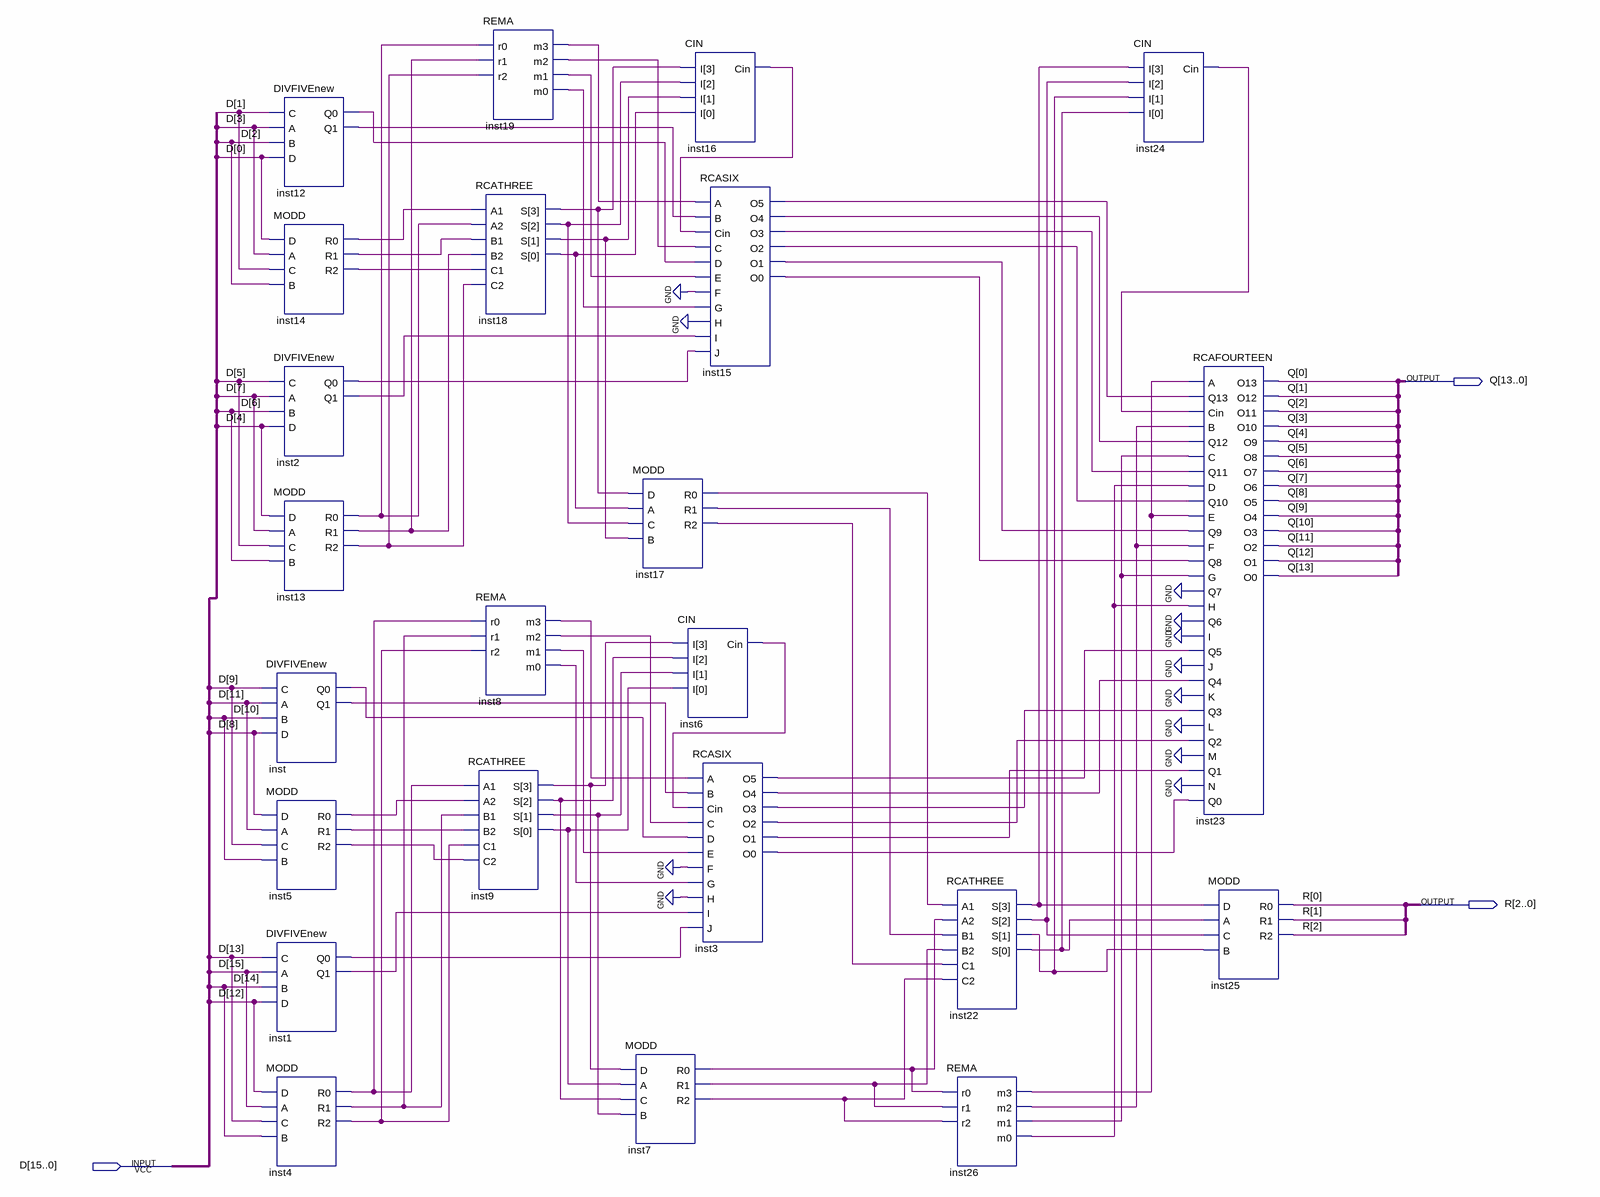
[diagram p0: schematic sheet]
// Quartus schematic DIV.bdf as structural Verilog: 23 symbols, 3 pins
module DIV (
  input  [15:0] D,
  output [13:0] Q,
  output [2:0] R
);

  wire inst1_q0, inst1_q1, inst2_q0, inst2_q1, inst3_o0, inst3_o1, inst3_o2, inst3_o3, inst3_o4, inst3_o5,
       inst4_r0, inst4_r1, inst4_r2, inst5_r0, inst5_r1, inst5_r2, inst6_cin, inst7_r0, inst7_r1, inst7_r2,
       inst8_m0, inst8_m1, inst8_m2, inst8_m3, inst9_s, inst9_s_2, inst9_s_3, inst9_s_4, inst12_q0,
       inst12_q1, inst13_r0, inst13_r1, inst13_r2, inst14_r0, inst14_r1, inst14_r2, inst15_o0, inst15_o1,
       inst15_o2, inst15_o3, inst15_o4, inst15_o5, inst16_cin, inst17_r0, inst17_r1, inst17_r2, inst18_s,
       inst18_s_2, inst18_s_3, inst18_s_4, inst19_m0, inst19_m1, inst19_m2, inst19_m3, inst22_s, inst22_s_2,
       inst22_s_3, inst22_s_4, inst24_cin, inst26_m0, inst26_m1, inst26_m2, inst26_m3, inst_q0, inst_q1;

  DIVFIVEnew inst12 (.C(D[1]), .A(D[3]), .B(D[2]), .D(D[0]), .Q0(inst12_q0), .Q1(inst12_q1));
  MODD inst14 (.D(D[0]), .A(D[3]), .C(D[1]), .B(D[2]), .R0(inst14_r0), .R1(inst14_r1), .R2(inst14_r2));
  DIVFIVEnew inst2 (.C(D[5]), .A(D[7]), .B(D[6]), .D(D[4]), .Q0(inst2_q0), .Q1(inst2_q1));
  MODD inst13 (.D(D[4]), .A(D[7]), .C(D[5]), .B(D[6]), .R0(inst13_r0), .R1(inst13_r1), .R2(inst13_r2));
  DIVFIVEnew inst (.C(D[9]), .A(D[11]), .B(D[10]), .D(D[8]), .Q0(inst_q0), .Q1(inst_q1));
  MODD inst5 (.D(D[8]), .A(D[11]), .C(D[9]), .B(D[10]), .R0(inst5_r0), .R1(inst5_r1), .R2(inst5_r2));
  DIVFIVEnew inst1 (.C(D[13]), .A(D[15]), .B(D[14]), .D(D[12]), .Q0(inst1_q0), .Q1(inst1_q1));
  MODD inst4 (.D(D[12]), .A(D[15]), .C(D[13]), .B(D[14]), .R0(inst4_r0), .R1(inst4_r1), .R2(inst4_r2));
  REMA inst19 (
    .r0(inst13_r0), .r1(inst13_r1), .r2(inst13_r2), .m3(inst19_m3), .m2(inst19_m2), .m1(inst19_m1),
    .m0(inst19_m0));
  RCATHREE inst18 (
    .A1(inst14_r0), .A2(inst13_r0), .B1(inst14_r1), .B2(inst13_r1), .C1(inst14_r2), .C2(inst13_r2),
    .S({inst18_s, inst18_s_3, inst18_s_4, inst18_s_2}));
  REMA inst8 (.r0(inst4_r0), .r1(inst4_r1), .r2(inst4_r2), .m3(inst8_m3), .m2(inst8_m2), .m1(inst8_m1), .m0(inst8_m0));
  RCATHREE inst9 (
    .A1(inst4_r0), .A2(inst5_r0), .B1(inst4_r1), .B2(inst5_r1), .C1(inst4_r2), .C2(inst5_r2),
    .S({inst9_s, inst9_s_3, inst9_s_4, inst9_s_2}));
  MODD inst17 (
    .D(inst18_s), .A(inst18_s_2), .C(inst18_s_3), .B(inst18_s_4), .R0(inst17_r0), .R1(inst17_r1),
    .R2(inst17_r2));
  MODD inst7 (.D(inst9_s), .A(inst9_s_2), .C(inst9_s_3), .B(inst9_s_4), .R0(inst7_r0), .R1(inst7_r1), .R2(inst7_r2));
  CIN inst16 (.I({inst18_s, inst18_s_3, inst18_s_4, inst18_s_2}), .Cin(inst16_cin));
  RCASIX inst15 (
    .A(inst19_m3), .B(inst12_q1), .Cin(inst16_cin), .C(inst19_m2), .D(inst12_q0), .E(inst19_m1), .F(1'b0),
    .G(inst19_m0), .H(1'b0), .I(inst2_q1), .J(inst2_q0), .O5(inst15_o5), .O4(inst15_o4), .O3(inst15_o3),
    .O2(inst15_o2), .O1(inst15_o1), .O0(inst15_o0));
  CIN inst6 (.I({inst9_s, inst9_s_3, inst9_s_4, inst9_s_2}), .Cin(inst6_cin));
  RCASIX inst3 (
    .A(inst8_m3), .B(inst_q1), .Cin(inst6_cin), .C(inst8_m2), .D(inst_q0), .E(inst8_m1), .F(1'b0),
    .G(inst8_m0), .H(1'b0), .I(inst1_q1), .J(inst1_q0), .O5(inst3_o5), .O4(inst3_o4), .O3(inst3_o3),
    .O2(inst3_o2), .O1(inst3_o1), .O0(inst3_o0));
  RCATHREE inst22 (
    .A1(inst17_r0), .A2(inst7_r0), .B1(inst17_r1), .B2(inst7_r1), .C1(inst17_r2), .C2(inst7_r2),
    .S({inst22_s, inst22_s_3, inst22_s_4, inst22_s_2}));
  REMA inst26 (
    .r0(inst7_r0), .r1(inst7_r1), .r2(inst7_r2), .m3(inst26_m3), .m2(inst26_m2), .m1(inst26_m1),
    .m0(inst26_m0));
  CIN inst24 (.I({inst22_s, inst22_s_3, inst22_s_4, inst22_s_2}), .Cin(inst24_cin));
  RCAFOURTEEN inst23 (
    .A(inst26_m3), .Q13(inst15_o5), .Cin(inst24_cin), .B(inst26_m2), .Q12(inst15_o4), .C(inst26_m1),
    .Q11(inst15_o3), .D(inst26_m0), .Q10(inst15_o2), .E(inst26_m3), .Q9(inst15_o1), .F(inst26_m2),
    .Q8(inst15_o0), .G(inst26_m1), .Q7(1'b0), .H(inst26_m0), .Q6(1'b0), .I(1'b0), .Q5(inst3_o5), .J(1'b0),
    .Q4(inst3_o4), .K(1'b0), .Q3(inst3_o3), .L(1'b0), .Q2(inst3_o2), .M(1'b0), .Q1(inst3_o1), .N(1'b0),
    .Q0(inst3_o0), .O13(Q[0]), .O12(Q[1]), .O11(Q[2]), .O10(Q[3]), .O9(Q[4]), .O8(Q[5]), .O7(Q[6]),
    .O6(Q[7]), .O5(Q[8]), .O4(Q[9]), .O3(Q[10]), .O2(Q[11]), .O1(Q[12]), .O0(Q[13]));
  MODD inst25 (.D(inst22_s), .A(inst22_s_2), .C(inst22_s_3), .B(inst22_s_4), .R0(R[0]), .R1(R[1]), .R2(R[2]));
endmodule
